# Altium schematic sheet [06]-Headers.SchDoc: ENTER SHEET TITLE
size B; Engineer: ENTER ENGINEER NAME; Organization: CUAir; Address1: L3, 12a Rodborough Rd; Address2: Frenchs Forest; Address3: NSW; Address4: Australia 2086; Revision: ENTER REVISION NUMBER; CompetitionYear: 2019; CPN: ENTER CPN; PROJECT: ENTER PROJECT NAME
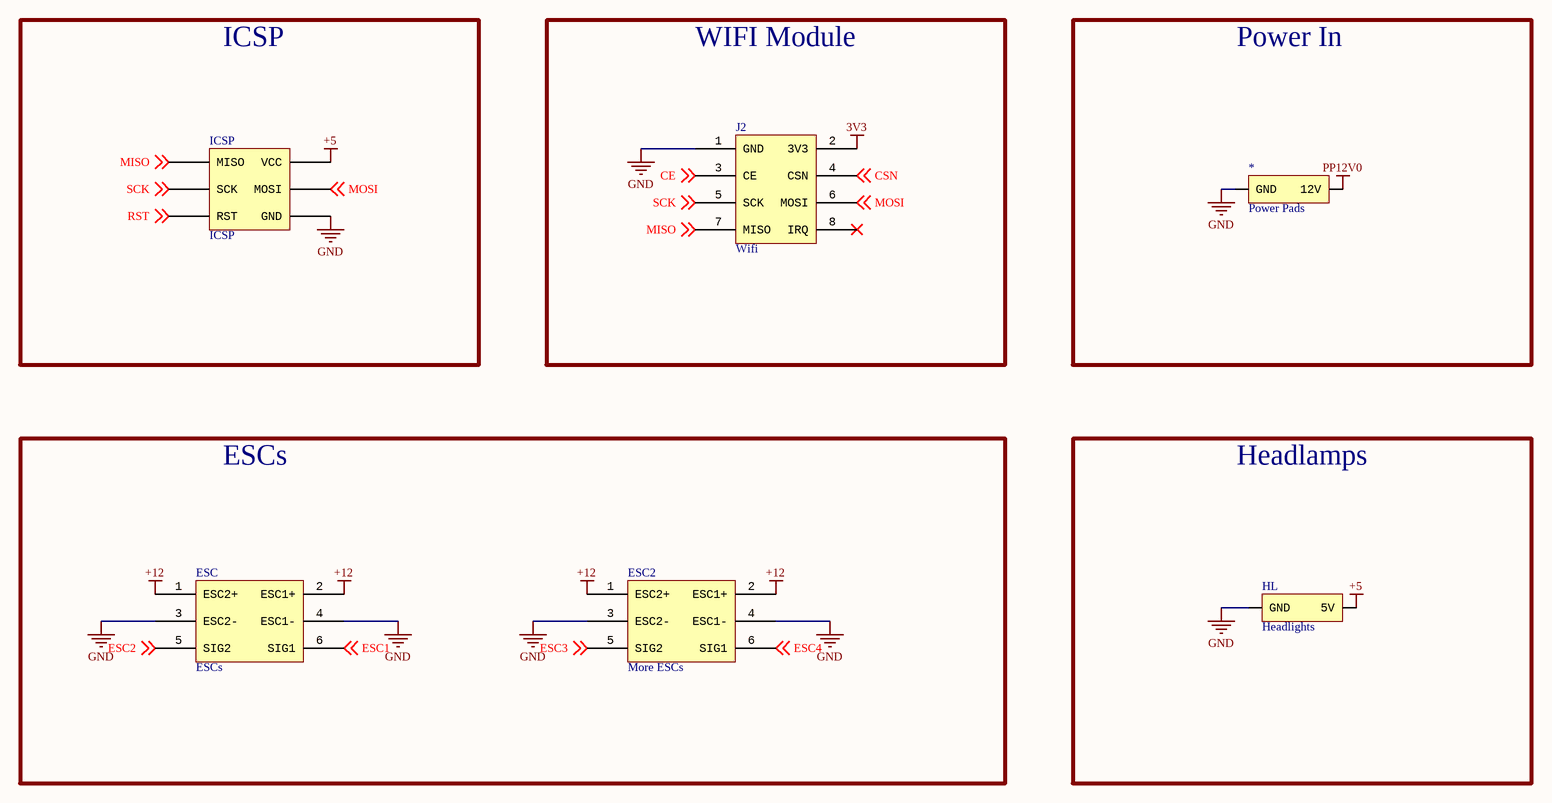
[diagram p0: [06]-Headers.SchDoc]

## Parts
*  Power Pads  [Power_Switch]
ESC  ESCs  [ESC Pads]
ESC2  More ESCs  [ESC Pads]
HL  Headlights  [Headlamps]
ICSP  ICSP  [ICSP]
J2  Wifi  [Wifi]

## Blocks framed on the sheet
ICSP: ICSP
WIFI Module: J2
Power In: *
ESCs: ESC ESC2
Headlamps: HL

## Nets
3V3: J2.2(3V3)
+5: HL.2(5V) ICSP.1(VCC)
+12: ESC.1(ESC2+) ESC.2(ESC1+) ESC2.1(ESC2+) ESC2.2(ESC1+)
GND: *.1(GND) ESC.3(ESC2-) ESC.4(ESC1-) ESC2.3(ESC2-) ESC2.4(ESC1-) HL.1(GND) ICSP.3(GND) J2.1(GND)
PP12V0: *.2(12V)
CE: J2.3(CE) ; off-sheet CE
CSN: J2.4(CSN) ; off-sheet CSN
ESC1: ESC.6(SIG1) ; off-sheet ESC1
ESC2: ESC.5(SIG2) ; off-sheet ESC2
ESC3: ESC2.5(SIG2) ; off-sheet ESC3
ESC4: ESC2.6(SIG1) ; off-sheet ESC4
MISO: ICSP.4(MISO) J2.7(MISO) ; off-sheet MISO
MOSI: ICSP.2(MOSI) J2.6(MOSI) ; off-sheet MOSI
RST: ICSP.6(RST) ; off-sheet RST
SCK: ICSP.5(SCK) J2.5(SCK) ; off-sheet SCK

Not connected (* = marked no-connect by the designer): J2 8(IRQ)*

## Notes on the sheet
- Project
- Title
- Size:
- Date:
- B
- Number:
- Revision:
- File:

## Library data of the parts
ESC2 = ESCs